# EasyEDA schematic SCH_task1_2026-04-27.json
TITLE: Sheet_1; REV: 1.0; Date: 2026-04-27; Sheet: 1/1; Drawn By: nare.manukian222; Company: Your Company
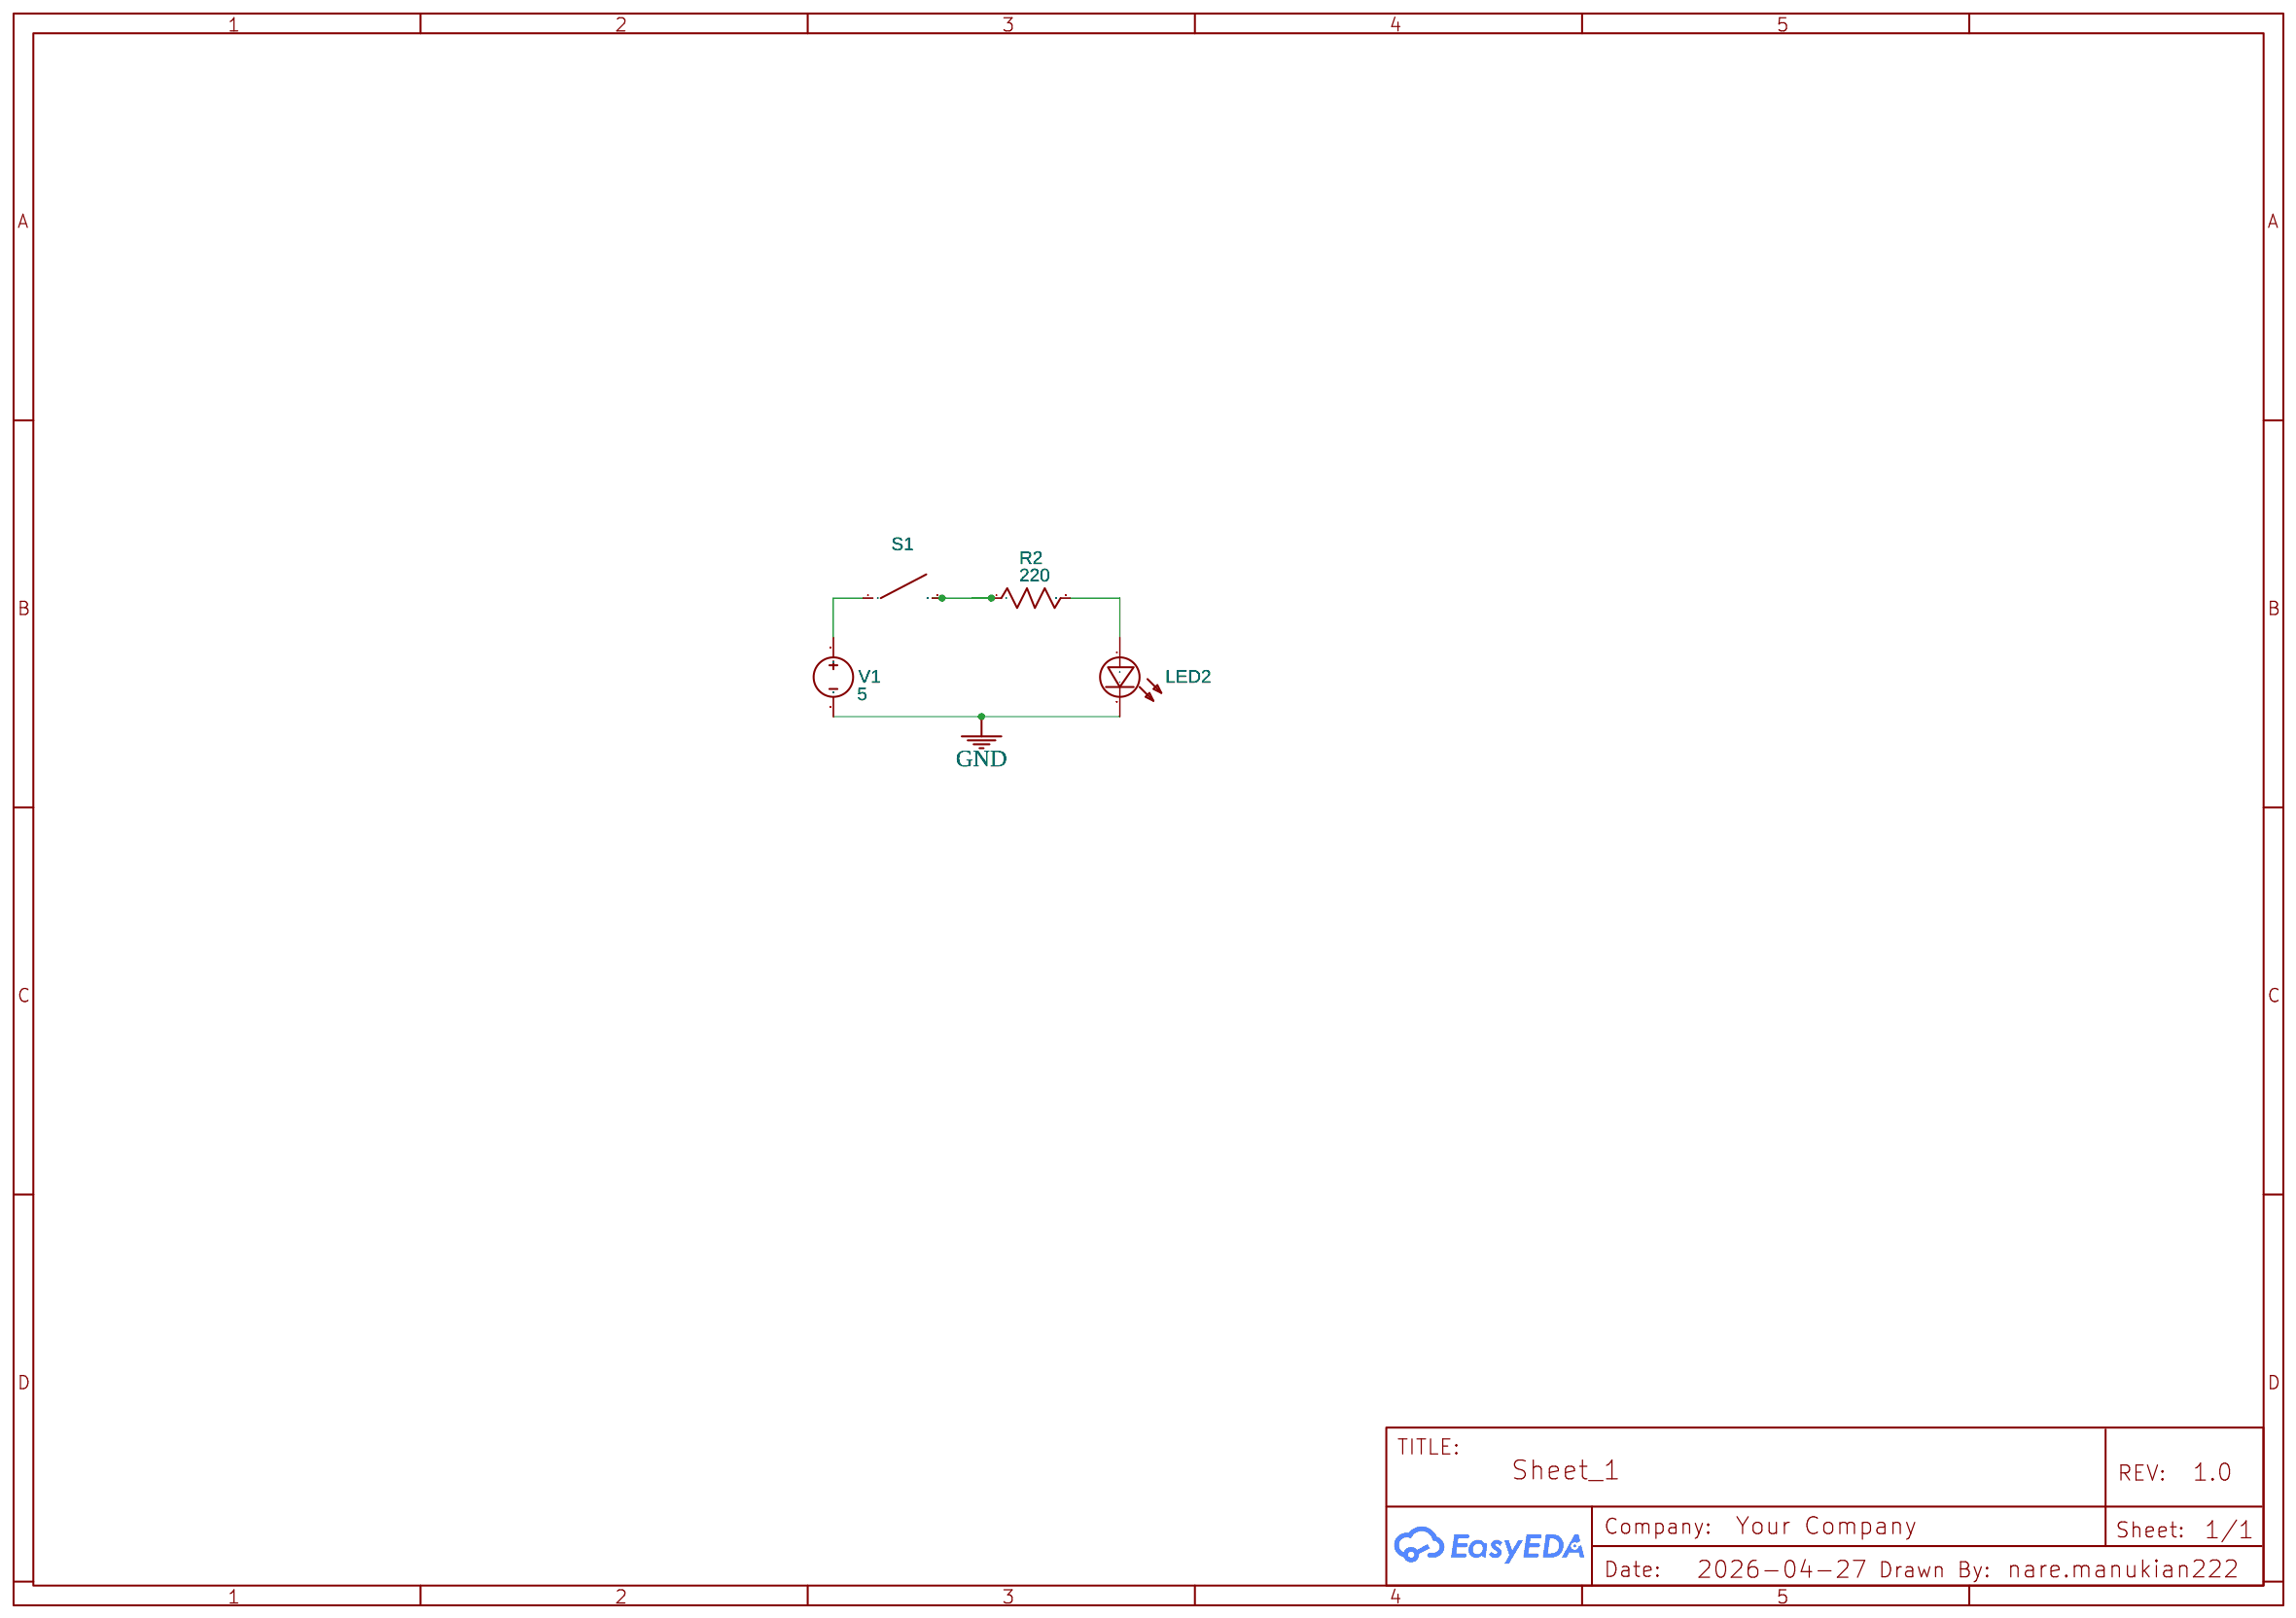
[diagram p0: schematic sheet]

## Parts
LED2  LED  [LED-SMD_3P-L6.5-W6.5-LED12W-6565]
R2  220  [AXIAL-0.3]
S1  SPST_Open  [PUSHBUTTON_2PINS-MY CUSTOM BUTTON]
V1  5  [HDR1X2]

## Library data of the parts
LED2 = LED: catid: 20; Contributor: 仿真库绘制; Color: Red; NameDisplay: 0
R2 = Resistor_US: Resistance: 1k; Contributor: EasyEDA; Supplier: YUJING
S1 = SPST: catid: 20; State: Open; Contributor: EasyEDA; NameDisplay: 0
V1 = VDC: Contributor: EasyEDA; sim: true

## Nets
GND: LED2.2(-) V1.2
Net-(LED2-1): LED2.1(+) R2.2
Net-(R2-1): R2.1 S1.2
Net-(S1-1): S1.1 V1.1
